# EasyEDA Pro project STC-FOC-C2822.epro, board STC-FOC_V1
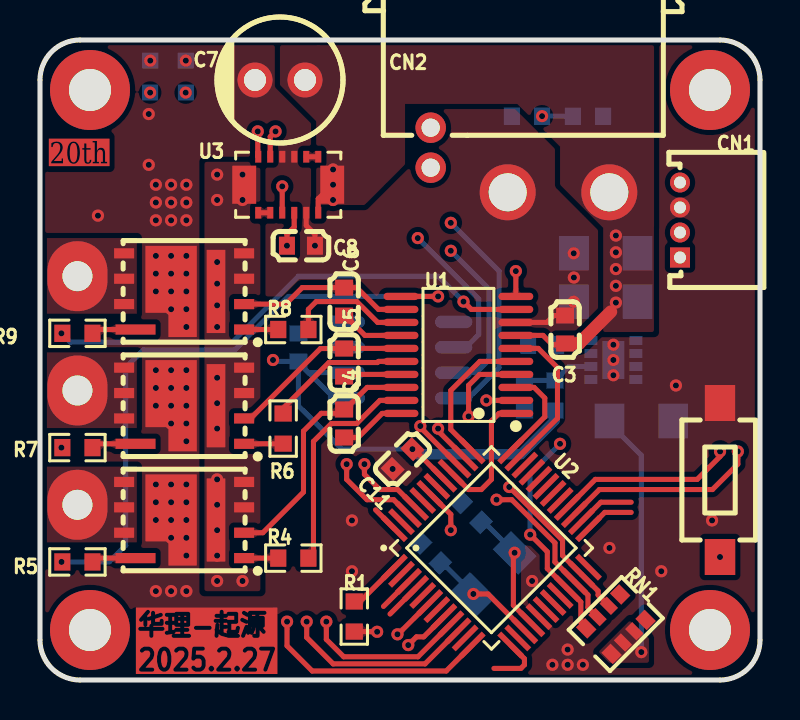
[diagram p3: board, top side]
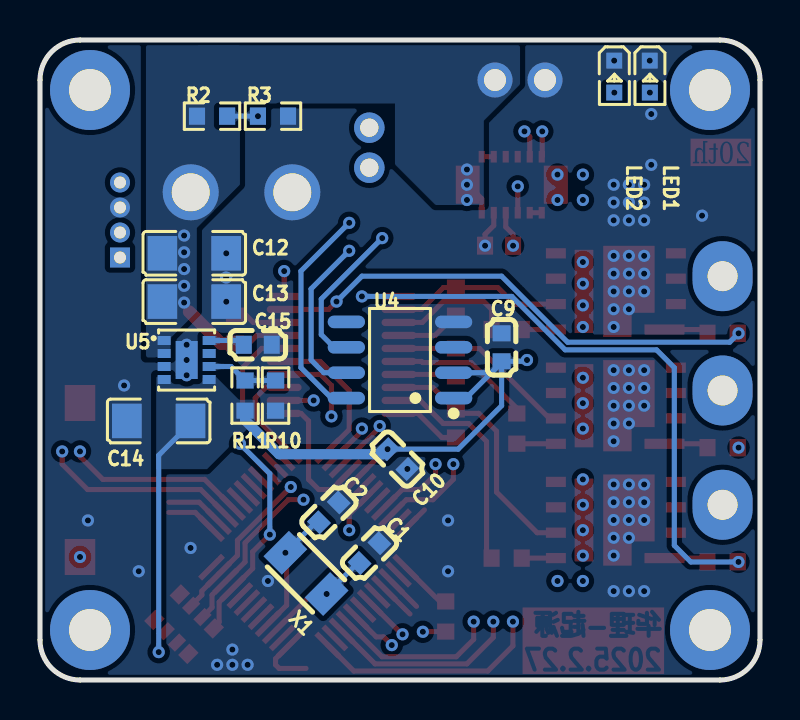
[diagram p4: board, bottom side, seen from below]

Outline 36 x 32 mm; copper layers: Top Layer, Inner1, Inner2, Bottom Layer. Coordinates in mm from the lower left corner of the outline.
Outline path: 0,30 0,2 arc(0.59,0.59) 2,0 34,0 arc(35.41,0.59) 36,2 36,30 arc(35.41,31.41) 34,32 2,32 arc(0.59,31.41) 0,30
Stack: Top Layer 0.035mm 外层铜厚1oz / Dielectric1 0.2104mm 7628 RC49% 8.6mil / Inner1 0.0152mm 内层铜厚 / Dielectric2 1.065mm 1.1mm H/HOZ 含铜 / Inner2 0.0152mm 内层铜厚 / Dielectric3 0.2104mm 7628 RC49% 8.6mil / Bottom Layer 0.035mm 外层铜厚1oz

## Design rules (mm)
net D-: DP2
net D+: DP2
template: xyf_v1.1
spacing copperThickness1oz (default): track to track 0.102, other pairs 0.152 to 0.3
spacing copperThickness2oz: track to track 0.203, other pairs 0.152 to 0.3
spacing 0焊盘板框间距: track to track 0.152, other pairs 0 to 0.3
spacing copperThicknessInner0.5oz: track to track 0.089, other pairs 0.152 to 0.3
track width copperThickness1oz (default): min 0.127, default 0.254, max 2.54
track width copperThickness2oz: min 0.203, default 0.254, max 2.54
track width copperThickness0.5oz: min 0.089, default 0.254, max 2.54
differential pair differentialPair (default): width min 0.127, default 0.254, max 2.54; gap min 0.152, default 0.152
via viaSize (default): diameter min 0.5, default 0.61, max 10; hole min 0.3, default 0.305, max 6.3
via viaSize2: diameter min 0.5, default 0.61, max 10; hole min 0.3, default 0.305, max 6.299
via viaSize4: diameter min 0.45, default 0.61, max 10; hole min 0.3, default 0.305, max 6.299

## Placement (name value [footprint] x y rotation side)
C1  15pF  [C0603]  19.52 6.35 315 bottom
C2  15pF  [C0603]  21.56 8.38 315 bottom
C3  100nF  [C0603]  26.25 17.52 270 top
C4  1uF  [C0603]  15.21 12.83 270 top
C5  1uF  [C0603]  15.21 15.87 270 top
C6  1uF  [C0603]  15.21 18.92 270 top
C7  470uF  [CAP-TH_BD6.3-P2.50-D0.6-FD-1]  12 30 180 top
C8  22uF  [C0603]  13.05 21.72 180 top
C9  100nF  [C0603]  12.92 16.64 270 bottom
C10  100nF  [C0603]  18.13 11.05 45 bottom
C11  22uF  [C0603]  18.13 11.05 45 top
C12  22uF  [C1206]  28.29 21.33 0 bottom
C13  22uF  [C1206]  28.29 18.92 0 bottom
C14  22uF  [C1206]  30.06 12.95 180 bottom
C15  430pF  [C0603]  25.11 16.76 180 bottom
CN1  HC-1.25-4AW  [CONN-TH_4P-P1.25_HCTL_HC-1.25-4AW]  32 23 90 top
CN2  XT30PW(2+2)-M.G.B  [CONN-TH_4P-XT30PW-M]  24 26 180 top
LED1  NCD0603R1  [LED0603-RD_RED]  5.51 30.17 270 bottom
LED2  NCD0603C1  [LED0603-RD]  7.29 30.17 270 bottom
NOREF  -  [Pad_e38]  1.87 8.76 0 top
NOREF#2  -  [Pad_e41]  1.87 20.19 0 top
NOREF#3  -  [Pad_e23]  1.87 14.48 0 top
Q1  SIZF906BDT-T1-GE3  [PQFN-8_L6.0-W5.0-P1.27-BL-EP_ONSEMI_483AT]  7.21 8 90 top
Q2  SIZF906BDT-T1-GE3  [PQFN-8_L6.0-W5.0-P1.27-BL-EP_ONSEMI_483AT]  7.21 13.71 90 top
Q3  SIZF906BDT-T1-GE3  [PQFN-8_L6.0-W5.0-P1.27-BL-EP_ONSEMI_483AT]  7.21 19.43 90 top
R1  300Ω  [R0603]  15.71 3.17 270 top
R2  47kΩ  [R0603]  27.4 28.19 0 bottom
R3  10kΩ  [R0603]  24.35 28.19 0 bottom
R4  5.6Ω  [R0603]  12.67 6.09 180 top
R5  5.6Ω  [R0603]  1.87 5.9 0 top
R6  5.6Ω  [R0603]  12.16 12.57 270 top
R7  5.6Ω  [R0603]  1.87 11.62 0 top
R8  5.6Ω  [R0603]  12.67 17.52 180 top
R9  5.6Ω  [R0603]  1.87 17.33 0 top
R10  100kΩ  [R0603]  24.22 14.22 270 bottom
R11  309kΩ  [R0603]  25.75 14.22 90 bottom
RN1  750Ω  [RES-ARRAY-SMD_0603-8P-L3.2-W1.6-BL]  28.79 2.79 45 top
SCREW1  -  [M2螺丝]  2.5 29.5 0 top
SCREW2  -  [M2螺丝]  33.5 29.5 0 top
SCREW3  -  [M2螺丝]  2.5 2.5 0 top
SCREW4  -  [M2螺丝]  33.5 2.5 0 top
SW1  TS3625A  [KEY-SMD_L6.0-W3.5-LS8.4]  34 10 90 top
U1  DRV8300DPWR  [TSSOP-20_L6.5-W4.4-P0.65-LS6.4-BL]  20.92 16.25 90 top
U2  AI8051U-34K64-QFP48  [LQFP-48_L7.0-W7.0-P0.50-LS9.0-BL_1]  22.57 6.6 315 top
U3  INA745BIRELR  [VQFN14_REL_TEX]  12.41 24.76 270 top
U4  MT6701CT-STD  [SOP-8_L4.9-W3.9-P1.27-LS6.0-BL]  18 16 90 bottom
U5  TPS82130SILR  [USIP-8_L3.0-W2.8-P0.65-TL-EP]  28.67 16 180 bottom
X1  32.768kHz  [CRYSTAL-SMD_L3.2-W1.5]  22.7 5.33 225 bottom

## Footprints (pads in the part's own frame, mm; a bottom-side part is the same pattern mirrored in y, then rotated)
C0603
  rect 0.8x0.9 smd: 1(-0.7,0) 2(0.7,0)
C1206
  rect 1.485x1.728 smd: 1(-1.593,0) 2(1.593,0)
CAP-TH_BD6.3-P2.50-D0.6-FD-1
  round 1.75 hole 1.1: 1(-1.25,0) 2(1.25,0)
CONN-TH_4P-P1.25_HCTL_HC-1.25-4AW
  rect 1x1 hole 0.6: 1(-1.875,0)
  round 1 hole 0.6: 2(-0.625,0) 3(0.625,0) 4(1.875,0)
CONN-TH_4P-XT30PW-M
  round 2.8 hole 1.9: 1(-4.465,1.615) 2(0.615,1.615)
  round 1.524 hole 0.914: 3(4.465,0.385) 4(4.465,-1.615)
CRYSTAL-SMD_L3.2-W1.5
  rect 1.3x1.8 smd: 1(-1.458,0) 2(1.458,0)
KEY-SMD_L6.0-W3.5-LS8.4
  rect 1.8x1.524 smd: 1(-3.85,0) 2(3.85,0)
LED0603-RD
  rect 0.8x0.8 smd: 1(-0.799,0) 2(0.799,0)
LED0603-RD_RED
  rect 0.8x0.8 smd: 1(-0.799,-0.004) 2(0.799,0.004)
LQFP-48_L7.0-W7.0-P0.50-LS9.0-BL_1
  rect 0.28x1.62 smd: 1(-2.75,-4.11) 2(-2.25,-4.11) 3(-1.75,-4.11) 4(-1.25,-4.11) 5(-0.75,-4.11) 6(-0.25,-4.11) 7(0.25,-4.11) 8(0.75,-4.11) 9(1.25,-4.11) 10(1.75,-4.11) 11(2.25,-4.11) 12(2.75,-4.11) 25(2.75,4.11) 26(2.25,4.11) 27(1.75,4.11) 28(1.25,4.11) 29(0.75,4.11) 30(0.25,4.11) 31(-0.25,4.11) 32(-0.75,4.11) 33(-1.25,4.11) 34(-1.75,4.11) 35(-2.25,4.11) 36(-2.75,4.11)
  rect 1.62x0.28 smd: 13(4.11,-2.75) 14(4.11,-2.25) 15(4.11,-1.75) 16(4.11,-1.25) 17(4.11,-0.75) 18(4.11,-0.25) 19(4.11,0.25) 20(4.11,0.75) 21(4.11,1.25) 22(4.11,1.75) 23(4.11,2.25) 24(4.11,2.75) 37(-4.11,2.75) 38(-4.11,2.25) 39(-4.11,1.75) 40(-4.11,1.25) 41(-4.11,0.75) 42(-4.11,0.25) 43(-4.11,-0.25) 44(-4.11,-0.75) 45(-4.11,-1.25) 46(-4.11,-1.75) 47(-4.11,-2.25) 48(-4.11,-2.75)
M2螺丝
  round 4 hole 2.1: 1(0,0)
Pad_e23
  oval 3x3.5 hole 1.5: 1(0,0)
Pad_e38
  oval 3x3.5 hole 1.5: 1(0,0)
Pad_e41
  oval 3x3.5 hole 1.5: 1(0,0)
PQFN-8_L6.0-W5.0-P1.27-BL-EP_ONSEMI_483AT
  rect 0.51x1 smd: 1(-1.905,-3) 2(-0.635,-3) 3(0.635,-3) 4(1.905,-3) 5(1.905,3) 6(0.635,3) 7(-0.635,3)
  rect 0.51x2 smd: 8(-1.905,2.43)
  custom 4.56x2.57 smd: 9(0,0.65)
  rect 4.16x0.93 smd: 10(0,-1.595)
R0603
  rect 0.806x0.864 smd: 1(-0.753,0) 2(0.753,0)
RES-ARRAY-SMD_0603-8P-L3.2-W1.6-BL
  rect 0.65x0.8 smd: 1(-1.2,-0.9) 4(1.2,-0.9) 5(1.2,0.9) 8(-1.2,0.9)
  rect 0.5x0.8 smd: 2(-0.4,-0.9) 3(0.4,-0.9) 6(0.4,0.9) 7(-0.4,0.9)
SOP-8_L4.9-W3.9-P1.27-LS6.0-BL
  oval 0.63x1.865 smd: 1(-1.905,-2.683) 2(-0.635,-2.683) 3(0.635,-2.683) 4(1.905,-2.683) 5(1.905,2.683) 6(0.635,2.683) 7(-0.635,2.683) 8(-1.905,2.683)
TSSOP-20_L6.5-W4.4-P0.65-LS6.4-BL
  oval 0.364x1.742 smd: 1(-2.925,-2.871) 2(-2.275,-2.871) 3(-1.625,-2.871) 4(-0.975,-2.871) 5(-0.325,-2.871) 6(0.325,-2.871) 7(0.975,-2.871) 8(1.625,-2.871) 9(2.275,-2.871) 10(2.925,-2.871) 11(2.925,2.871) 12(2.275,2.871) 13(1.625,2.871) 14(0.975,2.871) 15(0.325,2.871) 16(-0.325,2.871) 17(-0.975,2.871) 18(-1.625,2.871) 19(-2.275,2.871) 20(-2.925,2.871)
USIP-8_L3.0-W2.8-P0.65-TL-EP
  rect 0.65x0.45 smd: 1(-1.125,0.975) 2(-1.125,0.325) 3(-1.125,-0.325) 4(-1.125,-0.975) 5(1.125,-0.975) 6(1.125,-0.325) 7(1.125,0.325) 8(1.125,0.975)
  rect 1.1x1.9 smd: 9(0,0)
VQFN14_REL_TEX
  rect 0.584x0.305 smd: 1(-1.4,1.5) 2(-1.4,0.9) 3(-1.4,0.3) 4(-1.4,-0.3) 5(-1.4,-0.9) 6(-1.4,-1.5) 8(1.4,-1.5) 9(1.4,-0.9) 10(1.4,-0.3) 11(1.4,0.3) 12(1.4,0.9) 13(1.4,1.5)
  rect 1.905x1.194 smd: 7(0,-2.2) 14(0,2.2)

## Nets
As in the schematic, except:
OUT_A: NOREF.1 Q1.5 Q1.6 Q1.7
OUT_B: NOREF#3.1 Q2.5 Q2.6 Q2.7
OUT_C: NOREF#2.1 Q3.5 Q3.6 Q3.7

Pads without a net: CN1 4; RN1 4 5; SCREW1 1; SCREW2 1; SCREW3 1; SCREW4 1; U2 2 3 4 5 7 11 13 14 18 19 20 24 25 26 29 30 31 32 33 34 42 44 47 48; U4 3 5; U5 7

## Via types
v1: diameter 0.61, hole 0.305, Top Layer to Bottom Layer, 138 vias

## Routing (per net, layer and track width the routed paths; a pad name or vN(x,y) marks a point on that pad's centre or on a via; arc(x,y) is an arc through that point)
3V3: length 46.5
  Top Layer w0.254: v1(18.62,11.54) 18.69,11.54 U2.41 ; v1(12.35,21.72) 12.35,22.28 12.71,22.65 U3.11
  Inner1 w0.254: v1(11.65,16) 11.65,21.02 v1(12.35,21.72)
  Bottom Layer w0.254: U4.1 14.7,14.09 13.43,15.36 ; v1(11.65,16) 11.72,15.94 C9.2 12.92,15.88 13.43,15.36 ; 13.43,15.36 12.92,15.87 12.92,13.71 15.09,11.54 v1(18.62,11.54) ; 13.43,15.36 U4.2 ; C14.2 28.47,12.83 30.06,11.24 v1(30.06,1.39)
  Bottom Layer w0.508: v1(18.62,11.54) 18.88,11.29 24.05,11.29 25.75,12.99 R11.1
+9V: length 7.3
  Top Layer w0.254: U3.14 13.91,24.06 U3.13 ; U1.7 25.15,17.23 25.62,16.76 26.19,16.76 C3.2
  Top Layer w0.635: 28.54,18.41 26.95,16.82 C3.2
  vias: v1(14.65,25.53) v1(14.65,24.76) v1(14.65,24) v1(28.79,22.22) v1(28.79,21.39) v1(28.79,20.55) v1(28.79,19.71) v1(28.79,18.87)
GND: length 4.4
  Top Layer w0.254: C3.1 25.69,18.22 25.34,17.88 U1.8 ; U3.12 13.31,22.72 13.75,22.28 v1(13.75,21.72)
  vias: v1(2.9,23.22) v1(5.44,28.3) v1(5.44,25.76) v1(5.51,30.97) v1(5.79,24.76) v1(5.79,23.87) v1(5.79,22.98) v1(5.79,21.21) v1(5.79,20.32) v1(5.79,19.43) v1(5.79,15.49) v1(5.79,14.6) v1(5.79,13.71) v1(5.79,9.78) v1(5.79,8.89) v1(5.79,8) v1(5.79,4.44) v1(6.56,24.76) v1(6.56,23.87) v1(6.56,22.98) v1(6.56,21.21) v1(6.56,20.32) v1(6.56,19.43) v1(6.56,18.54) v1(6.56,15.49) v1(6.56,14.6) v1(6.56,13.71) v1(6.56,12.83) v1(6.56,9.78) v1(6.56,8.89) v1(6.56,8) v1(6.56,7.11) v1(6.56,4.44) v1(7.29,30.97) v1(7.32,24.76) v1(7.32,23.87) v1(7.32,22.98) v1(7.32,21.21) v1(7.32,20.32) v1(7.32,19.43) v1(7.32,18.54) v1(7.32,17.65) v1(7.32,15.49) v1(7.32,14.6) v1(7.32,13.71) v1(7.32,12.83) v1(7.32,11.94) v1(7.32,9.78) v1(7.32,8.89) v1(7.32,8) v1(7.32,7.11) v1(7.32,6.22) v1(7.32,4.44) v1(15.6,7.98) v1(15.6,5.44) v1(17.63,10.55) v1(24.6,4.95) v1(25.62,0.76) v1(26.38,1.52) v1(26.38,0.76) v1(26.69,21.33) v1(26.69,20.12) v1(26.69,18.91) v1(27.14,0.76) v1(28.47,6.6) v1(28.67,16.76) v1(28.67,16) v1(28.67,15.24) v1(31.06,5.44) v1(31.8,14.73) v1(33.6,7.98)
PVCC:
  vias: v1(8.86,25.27) v1(8.86,24) v1(8.86,20.9) v1(8.86,19.82) v1(8.86,18.73) v1(8.86,17.65) v1(8.86,15.11) v1(8.86,13.84) v1(8.86,12.57) v1(8.86,10.03) v1(8.86,8.76) v1(8.86,7.49) v1(8.86,6.22) v1(8.86,4.95) v1(10.13,25.27) v1(10.13,24) v1(10.13,4.95)
(no net): length 13.2
  Top Layer w0.254: U2.13 24.22,1.06 24.22,0.76 24.04,0.58 22.7,0.58 ; 29.56,8.38 28.24,8.38 27.42,7.56 ; 27.07,7.92 28.04,8.89 29.56,8.89 ; 17.72,7.56 16.78,8.51 ; U2.4 17.5,3.3 ; U2.3 17.18,3.68
ADC_VCC: length 35
  Top Layer w0.254: v1(20.54,7.49) 20.54,8.28 19.49,9.33
  Inner2 w0.254: v1(20.54,7.49) 21.43,8.38 25.24,8.38 30.95,14.09 30.95,24.89 27.65,28.19 v1(25.1,28.19)
  Bottom Layer w0.254: R2.1 v1(25.1,28.19)
ALT: length 47.6
  Top Layer w0.254: RN1.8 27.31,2.63 27.04,2.89 27.04,3.9 U2.21 25.37,5.58 25.37,6.41 v1(24.51,7.27) ; U3.10 v1(12.11,24.68)
  Inner1 w0.254: v1(12.11,24.68) 12.11,25.06 10.25,26.92 10.25,27.62 11,28.37 16.02,28.37 16.84,29.18 22.21,29.18 25.59,25.8 25.59,12.22 v1(26,11.81)
  Bottom Layer w0.254: v1(26,11.81) 24.51,10.32 v1(24.51,7.27)
CLK: length 37.6
  Top Layer w0.254: v1(14.32,2.92) 14.32,2.03 15.19,1.16 18.9,1.16 U2.9
  Inner2 w0.254: v1(14.32,2.92) 14.32,15.24 v1(20.54,21.46)
  Bottom Layer w0.254: U4.7 21.81,15.36 22.44,16 22.44,19.56 v1(20.54,21.46)
CSN: length 47.7
  Top Layer w0.254: U2.12 20.31,0.45 13.61,0.45 12.35,1.71 v1(12.35,2.92)
  Inner2 w0.254: v1(20.54,22.86) 17.62,22.86 12.35,17.59 v1(12.35,2.92)
  Bottom Layer w0.254: v1(20.54,22.86) 22.95,20.44 22.95,15.62 21.43,14.09 U4.8
D+: length 34.4
  Top Layer w0.254: v1(18.41,1.75) 18.82,2.16 19.19,2.16 U2.8
  Inner1 w0.254: CN1.2 32.33,22.38 33.24,21.46 33.24,9.65 24.73,1.14 19.02,1.14 v1(18.41,1.75)
D-: length 34.5
  Top Layer w0.254: 19.49,3.87 17.9,2.28 v1(17.87,2.28)
  Inner1 w0.254: v1(17.87,2.28) 18.23,2.64 arc(18.43,2.72) 18.64,2.64 arc(18.84,2.55) 19.05,2.64 19.72,3.3 arc(19.8,3.51) 19.72,3.72 arc(19.63,3.92) 19.72,4.13 25.37,9.78 26.13,9.78 arc(26.67,9.55) 26.89,9.02 26.89,8.81 arc(27.65,8.05) 28.41,8.81 28.41,9.02 arc(28.64,9.55) 29.18,9.78 30.19,9.78 32,11.58 32,13.53 arc(32.12,13.82) 32.42,13.94 arc(32.71,14.07) 32.83,14.36 32.83,15.05 arc(32.71,15.35) 32.42,15.47 arc(32.12,15.59) 32,15.89 32,16.58 arc(32.12,16.87) 32.42,16.99 arc(32.71,17.11) 32.83,17.41 32.83,18.1 arc(32.71,18.39) 32.42,18.52 arc(32.12,18.64) 32,18.93 CN1.1
GHA: length 11.2
  Top Layer w0.254: R4.1 13.67,6.35 13.67,11.93 14.57,12.83 15.84,12.83 17,13.98 U1.19
GHB: length 7.1
  Top Layer w0.254: R6.1 12.16,13.59 14.44,15.87 16.87,15.87 16.93,15.93 U1.16
GHC: length 6.2
  Top Layer w0.254: R8.1 13.42,18.53 13.81,18.92 15.84,18.92 16.88,17.88 U1.13
GLA: length 31.4
  Top Layer w0.254: U1.11 v1(19.91,19.18)
  Bottom Layer w0.254: v1(19.91,19.18) 12.41,19.18 9.74,16.51 5.17,16.51 4.28,15.62 4.28,6.73 3.46,5.9 v1(1.08,5.9)
GLB: length 31.4
  Top Layer w0.254: U1.10 v1(23.79,20.44)
  Inner1 w0.254: v1(1.07,11.62) 1.77,10.92 13.81,10.92 15.21,9.52 16.35,9.52 16.86,10.03 16.86,12.06 22.7,17.91 22.7,19.35 v1(23.79,20.44)
GLC: length 25
  Top Layer w0.254: 23.79,18.53 21.57,18.53 v1(21.18,18.92)
  Bottom Layer w0.254: v1(21.18,18.92) 19.91,20.19 12.92,20.19 9.62,16.89 1.52,16.89 v1(1.07,17.33)
KEY: length 2.7
  Top Layer w0.254: 17.72,5.64 16.01,3.93 R1.1
LED_R: length 52.9
  Top Layer w0.254: U2.28 27.77,10.03 32.86,10.03 34,11.17 v1(34,11.43)
  Inner1 w0.254: v1(34,11.43) 34,23.97 28.39,29.59 16.74,29.59 15.88,28.73 6.16,28.73 5.55,29.33
  vias: v1(5.51,29.37)
LED_Y: length 53.8
  Top Layer w0.254: U2.27 27.97,9.52 33.62,9.52 34.89,10.79 v1(34.89,11.43)
  Inner1 w0.254: 7.33,29.33 9.24,31.24 27.78,31.24 34.89,24.13 v1(34.89,11.43)
  vias: v1(7.28,29.37)
MISO: length 38.7
  Top Layer w0.254: U2.10 19.25,0.81 14.66,0.81 13.34,2.13 v1(13.34,2.92)
  Inner2 w0.254: v1(13.34,2.92) 13.34,16.54 v1(18.89,22.1)
  Bottom Layer w0.254: v1(18.89,22.1) 21.94,19.05 21.94,17.27 21.3,16.64 U4.6
PWM1N: length 9.5
  Top Layer w0.254: v1(19.02,12.7) 19.02,12.63 U2.39 ; v1(21.43,13.18) 21.43,14.73 21.98,15.28 U1.4
  Inner1 w0.254: v1(21.43,13.18) 19.5,13.18 v1(19.02,12.7)
PWM1P: length 6.9
  Top Layer w0.254: 23.79,13.33 22.95,13.33 22.57,12.95 22.57,10.03 22.06,9.52 21.42,9.52 U2.40
PWM2N: length 7.3
  Top Layer w0.254: U2.37 20.54,12.52 20.54,14.48 21.99,15.93 U1.5
PWM2P: length 7.1
  Top Layer w0.254: U2.38 19.9,12.45 v1(19.9,12.57) ; U1.2 v1(22.32,13.98)
  Inner1 w0.254: v1(22.32,13.98) 22.32,12.95 21.94,12.57 19.91,12.57
PWM3N: length 7.8
  Top Layer w0.254: U2.35 25.87,13.09 25.87,15.62 24.91,16.58 U1.6
PWM3P: length 5
  Top Layer w0.254: U1.3 24.71,14.63 25.24,14.09 25.24,13.16 U2.36
RX2: length 20
  Top Layer w0.254: v1(16.22,10.79) 16.22,10.28 16.98,9.52 17.88,9.52 U2.45
  Inner1 w0.254: v1(16.22,10.79) 16.22,22.3 CN2.3
SCL: length 42.3
  Top Layer w0.254: v1(23.46,9.65) 26.13,6.98 26.13,6.23 27.91,4.45 27.91,4.25 RN1.6 ; v1(10.89,27.43) 10.89,26.19 U3.6
  Inner1 w0.254: v1(23.46,9.65) 25.24,11.43 25.24,25.65 22.06,28.83 16.98,28.83 16.17,28.01 11.47,28.01 v1(10.89,27.43)
SDA: length 43
  Top Layer w0.254: v1(11.78,27.43) 11.51,27.17 U3.5 ; RN1.7 27.4,3.62 27.4,4.25 U2.22 25.75,5.9 25.75,6.86 23.59,9.02 v1(22.83,9.02)
  Inner2 w0.254: v1(22.83,9.02) 22.83,11.81 25.49,14.48 25.49,24.89 21.18,29.21 16.09,29.21 14.32,27.43 v1(11.78,27.43)
SHA: length 12.6
  Top Layer w0.254: U1.18 16.36,14.63 15.26,13.53 C4.1 15.01,13.33 14.06,13.33 13.17,12.44 13.17,9.4 11.14,7.36 Q1.2
SHB: length 9.3
  Top Layer w0.254: Q2.2 10.53,13.08 14.02,16.57 15.21,16.57 15.21,16.58 U1.15
SHC: length 8.6
  Top Layer w0.254: Q3.2 12.28,18.79 13.11,19.62 15.83,19.62 16.93,18.53 18.05,18.53
TX2: length 23.1
  Top Layer w0.254: v1(15.33,10.79) 15.33,10.03 16.35,9.02 17.68,9.02 U2.46
  Inner1 w0.254: CN2.4 15.33,23.41 v1(15.33,10.79)
$1N7270: length 6.3
  Top Layer w0.254: v1(23.73,6.36) 23.67,6.3 23.67,3.74 U2.16
  Bottom Layer w0.254: v1(23.73,6.36) 22.21,7.89 22.05,7.89
$1N7283: length 5.6
  Top Layer w0.254: v1(21.67,4.3) 22.4,4.3 U2.15
  Bottom Layer w0.254: 20.02,5.85 20.12,5.85 v1(21.67,4.3)
$1N55931: length 21.3
  Top Layer w0.254: R1.2 16.85,2.42 v1(16.86,2.41)
  Inner2 w0.254: v1(34,6.15) 32.28,7.87 22.32,7.87 v1(16.86,2.41)
$1N57228: length 1.8
  Bottom Layer w0.254: C15.1 26.03,16.97 U5.8
$1N57378: length 3.6
  Bottom Layer w0.254: R10.1 R11.2 26.45,15.67 U5.6
$1N57561: length 0.6
  Top Layer w0.254: U3.2 U3.1
$1N57568: length 0.6
  Top Layer w0.254: U3.9 U3.8
$1N58049: length 3.3
  Top Layer w0.254: 18.05,13.33 17.11,13.33 15.9,12.12 C4.2
$1N58059: length 2.9
  Top Layer w0.254: C5.2 15.31,15.28 U1.17
$1N58070: length 3.3
  Top Layer w0.254: U1.14 16.25,17.23 15.26,18.22 C6.2
$1N58474: length 1.7
  Top Layer w0.254: Q1.1 R4.2
$1N58515: length 2.2
  Top Layer w0.254: Q1.8 2.81,6.09 R5.2
$1N58820: length 1.7
  Top Layer w0.254: Q2.1 11.91,11.81
$1N58822: length 2.2
  Top Layer w0.254: R7.2 2.81,11.81 Q2.8
$1N59023: length 1.7
  Top Layer w0.254: Q3.1 R8.2
$1N59025: length 2.2
  Top Layer w0.254: Q3.8 2.81,17.52 R9.2

## Copper pours and planes (outline as drawn; the poured copper is in the pictures)
3V3 on Top Layer: 29.54,3 30.45,2.09 30.45,0.86 28.47,0.86 27.92,1.41 29.51,3
3V3 on Bottom Layer: 30.19,15.24 29.47,15.24 29.47,15.02 29.3,14.86 28.03,14.86 27.91,14.98 27.91,15.25 27.28,15.25 26.05,14.01 25.24,14.01 25.24,12.95 27.65,10.54 30.19,10.54
+9V on Top Layer: 28.16,23.24 28.16,17.4 30.7,17.4 30.7,23.24
+9V on Top Layer: 13.81,32 13.81,23.75 16.22,23.75 18.25,25.78 18.25,28.81 23.86,28.81 26,26.67 26,24.76 28.16,22.6 30.7,22.6 30.7,32
+9V on Top Layer: 14.05,32 12,32 12,29.75 14.06,27.68 14.06,31.99
+9V on Bottom Layer: 12,32 12,29.78 13.81,27.97 13.81,23.75 16.22,23.75 18.25,25.78 18.25,28.83 28.12,28.83 28.12,32
+9V on Bottom Layer: 26,24.76 28.16,22.6 28.16,18.41 29.43,17.14 29.43,16.13 30.7,16.13 30.7,32.01 26,32.01
GND on Top Layer: -2.07,35.3 38.19,35.3 38.19,-3.18 -2.07,-3.18
GND on Bottom Layer: -2.07,35.3 38.19,35.3 38.19,-3.18 -2.07,-3.18
GND on Inner1: -2.07,35.3 38.19,35.3 38.19,-3.18 -2.07,-3.18
GND on Inner2: -2.07,35.3 38.19,35.3 38.19,-3.18 -2.07,-3.18
PVCC on Top Layer: 8.22,25.91 11.01,25.91 11.01,4.44 8.22,4.44
PVCC on Inner2: 8.22,25.91 11.01,25.91 11.01,4.44 8.22,4.44
OUT_A on Top Layer: 0.35,10.67 4.84,10.67 4.84,6.88 0.35,6.88
OUT_B on Top Layer: 0.35,16.38 4.84,16.38 4.84,12.6 0.35,12.6
OUT_C on Top Layer: 0.35,22.1 4.84,22.1 4.84,18.31 0.35,18.31

Small or netless copper shapes (teardrops, artwork), in the pictures only: 118 on Top Layer, 41 on Bottom Layer, 24 on Inner1, 12 on Inner2

## Text on the board
Top Layer: 20th | 华理-起源 / 2025.2.27
